# Altium schematic sheet outputs.SchDoc
size B; SheetNumber: 2; SheetTotal: 3
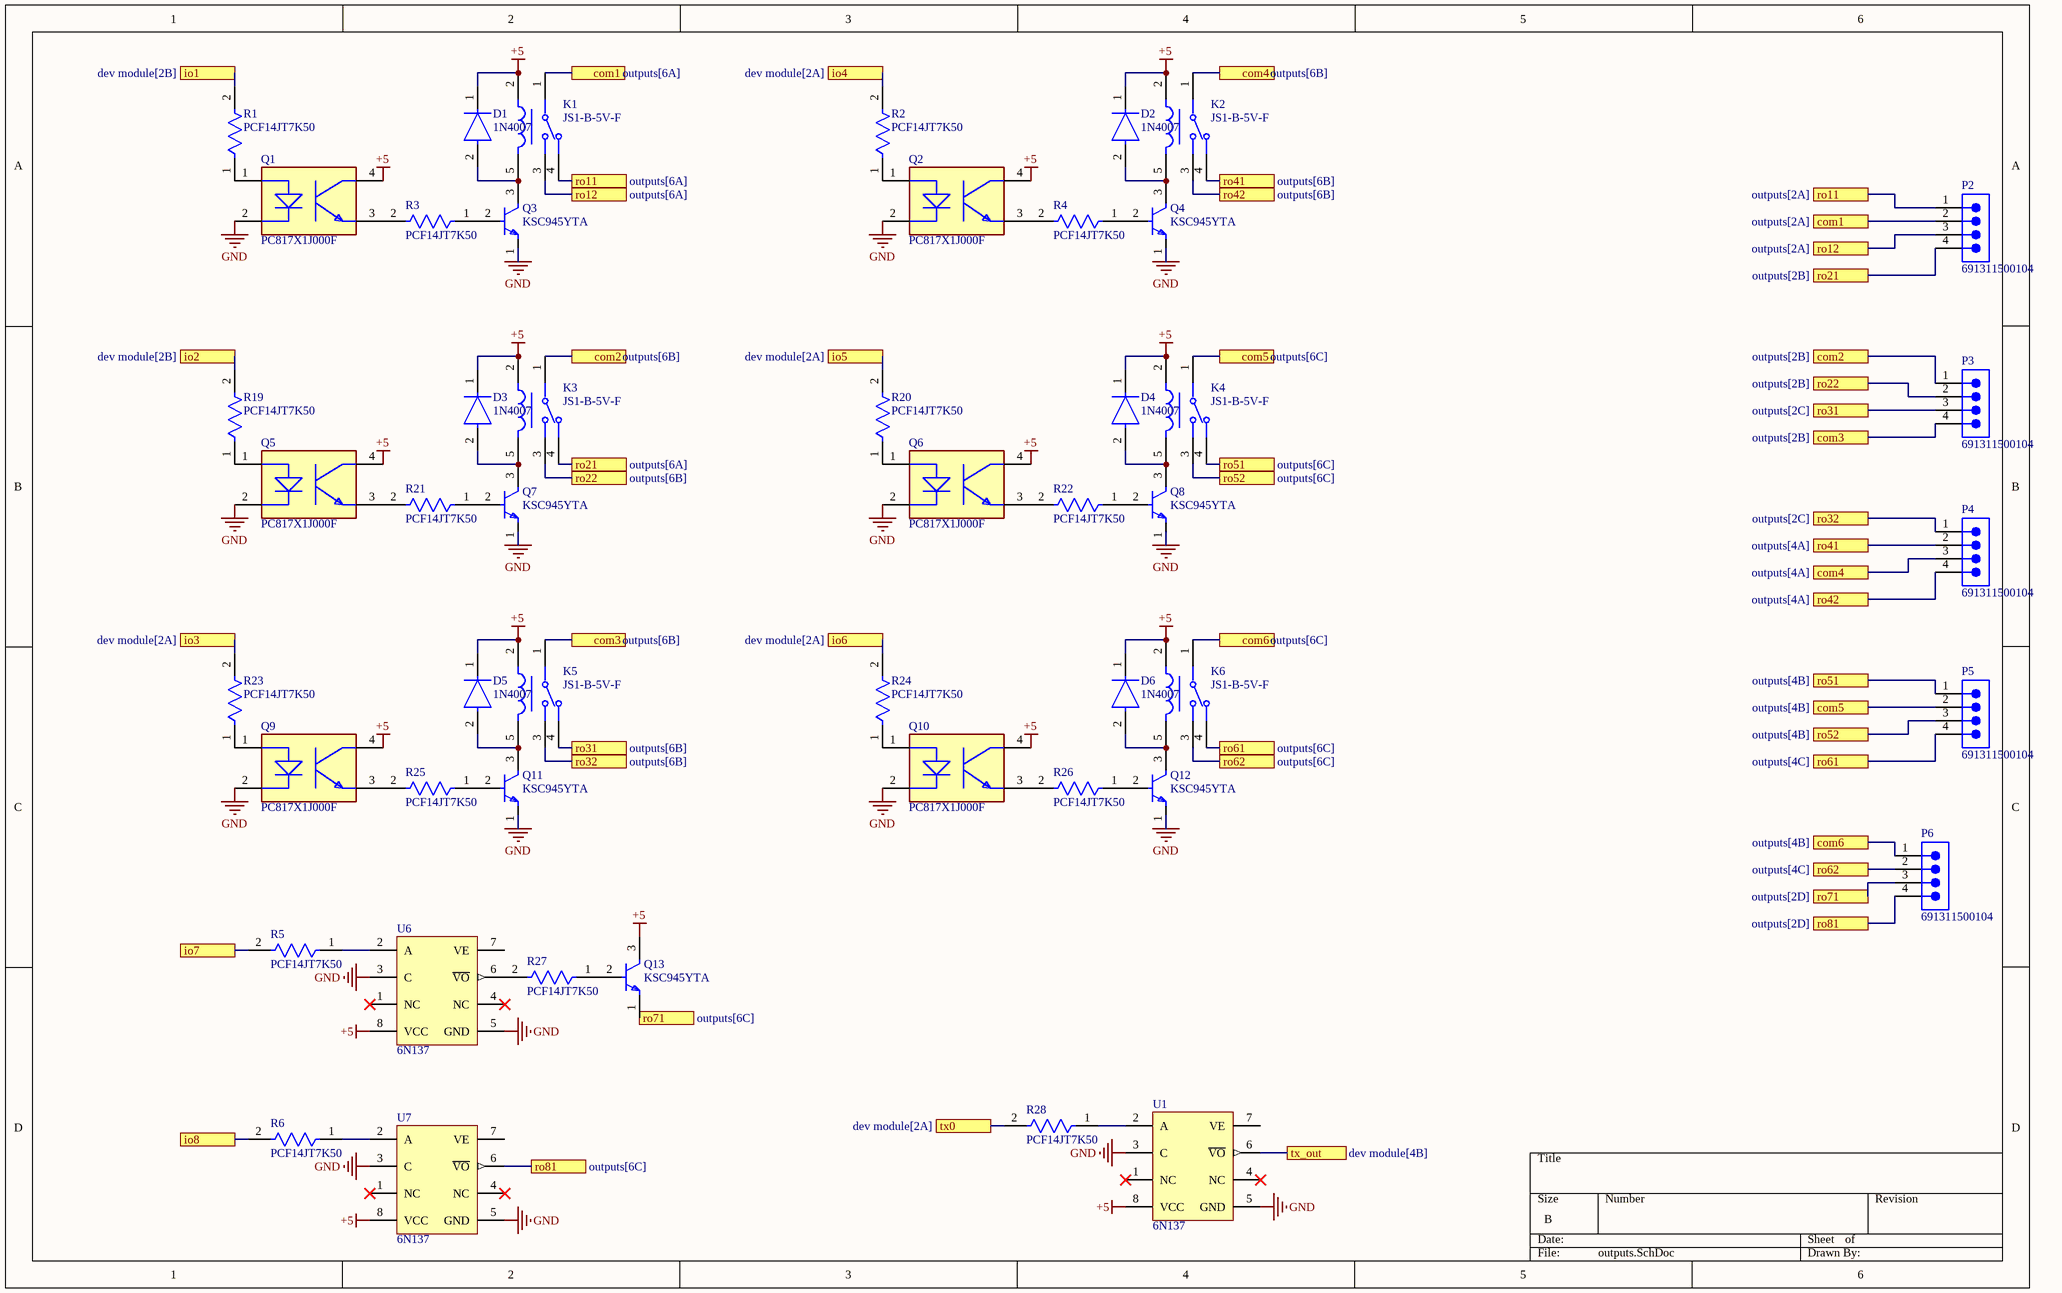
[diagram p0: outputs.SchDoc]

## Parts
D1  1N4007  [FP-1N4007-MFG]
D2  1N4007  [FP-1N4007-MFG]
D3  1N4007  [FP-1N4007-MFG]
D4  1N4007  [FP-1N4007-MFG]
D5  1N4007  [FP-1N4007-MFG]
D6  1N4007  [FP-1N4007-MFG]
K1  JS1-B-5V-F  [FP-JS1-B-5V-F-MFG]
K2  JS1-B-5V-F  [FP-JS1-B-5V-F-MFG]
K3  JS1-B-5V-F  [FP-JS1-B-5V-F-MFG]
K4  JS1-B-5V-F  [FP-JS1-B-5V-F-MFG]
K5  JS1-B-5V-F  [FP-JS1-B-5V-F-MFG]
K6  JS1-B-5V-F  [FP-JS1-B-5V-F-MFG]
P2  691311500104  [691311500104]
P3  691311500104  [691311500104]
P4  691311500104  [691311500104]
P5  691311500104  [691311500104]
P6  691311500104  [691311500104]
Q1  PC817X1J000F  [FP-PC817X1J000F-MFG]
Q2  PC817X1J000F  [FP-PC817X1J000F-MFG]
Q3  KSC945YTA  [FP-135AR-MFG]
Q4  KSC945YTA  [FP-135AR-MFG]
Q5  PC817X1J000F  [FP-PC817X1J000F-MFG]
Q6  PC817X1J000F  [FP-PC817X1J000F-MFG]
Q7  KSC945YTA  [FP-135AR-MFG]
Q8  KSC945YTA  [FP-135AR-MFG]
Q9  PC817X1J000F  [FP-PC817X1J000F-MFG]
Q10  PC817X1J000F  [FP-PC817X1J000F-MFG]
Q11  KSC945YTA  [FP-135AR-MFG]
Q12  KSC945YTA  [FP-135AR-MFG]
Q13  KSC945YTA  [FP-135AR-MFG]
R1  PCF14JT7K50  [FP-CF14-MFG]
R2  PCF14JT7K50  [FP-CF14-MFG]
R3  PCF14JT7K50  [FP-CF14-MFG]
R4  PCF14JT7K50  [FP-CF14-MFG]
R5  PCF14JT7K50  [FP-CF14-MFG]
R6  PCF14JT7K50  [FP-CF14-MFG]
R19  PCF14JT7K50  [FP-CF14-MFG]
R20  PCF14JT7K50  [FP-CF14-MFG]
R21  PCF14JT7K50  [FP-CF14-MFG]
R22  PCF14JT7K50  [FP-CF14-MFG]
R23  PCF14JT7K50  [FP-CF14-MFG]
R24  PCF14JT7K50  [FP-CF14-MFG]
R25  PCF14JT7K50  [FP-CF14-MFG]
R26  PCF14JT7K50  [FP-CF14-MFG]
R27  PCF14JT7K50  [FP-CF14-MFG]
R28  PCF14JT7K50  [FP-CF14-MFG]
U1  6N137  [VISH-DIP-8_A]
U6  6N137  [VISH-DIP-8_A]
U7  6N137  [VISH-DIP-8_A]

## Ports
com1 (see outputs[2A]), com1 (see outputs[6A]), com2 (see outputs[2B]), com2 (see outputs[6B]), com3 (see outputs[2B]), com3 (see outputs[6B]), com4 (see outputs[4A]), com4 (see outputs[6B]), com5 (see outputs[4B]), com5 (see outputs[6C]), com6 (see outputs[4B]), com6 (see outputs[6C]), io1 (see dev module[2B]), io2 (see dev module[2B]), io3 (see dev module[2A]), io4 (see dev module[2A]), io5 (see dev module[2A]), io6 (see dev module[2A]), io7, io8, ro11 (see outputs[2A]), ro11 (see outputs[6A]), ro12 (see outputs[2A]), ro12 (see outputs[6A]), ro21 (see outputs[2B]), ro21 (see outputs[6A]), ro22 (see outputs[2B]), ro22 (see outputs[6B]), ro31 (see outputs[2C]), ro31 (see outputs[6B]), ro32 (see outputs[2C]), ro32 (see outputs[6B]), ro41 (see outputs[4A]), ro41 (see outputs[6B]), ro42 (see outputs[4A]), ro42 (see outputs[6B]), ro51 (see outputs[4B]), ro51 (see outputs[6C]), ro52 (see outputs[4B]), ro52 (see outputs[6C]), ro61 (see outputs[4C]), ro61 (see outputs[6C]), ro62 (see outputs[4C]), ro62 (see outputs[6C]), ro71 (see outputs[2D]), ro71 (see outputs[6C]), ro81 (see outputs[2D]), ro81 (see outputs[6C]), tx0 (see dev module[2A]), tx_out (see dev module[4B])

## Nets
+5: D1.1(C) D2.1(C) D3.1(C) D4.1(C) D5.1(C) D6.1(C) K1.2 K2.2 K3.2 K4.2 K5.2 K6.2 Q1.4(C) Q2.4(C) Q5.4(C) Q6.4(C) Q9.4(C) Q10.4(C) Q13.3(C) U1.8(VCC) U6.8(VCC) U7.8(VCC)
GND: Q1.2(C) Q2.2(C) Q3.1(E) Q4.1(E) Q5.2(C) Q6.2(C) Q7.1(E) Q8.1(E) Q9.2(C) Q10.2(C) Q11.1(E) Q12.1(E) U1.3(C) U1.5(GND) U6.3(C) U6.5(GND) U7.3(C) U7.5(GND)
com1: K1.1(COM) P2.2 ; port com1
com2: K3.1(COM) P3.1 ; port com2
com3: K5.1(COM) P3.4 ; port com3
com4: K2.1(COM) P4.3 ; port com4
com5: K4.1(COM) P5.2 ; port com5
com6: K6.1(COM) P6.1 ; port com6
io1: R1.2 ; port io1
io2: R19.2 ; port io2
io3: R23.2 ; port io3
io4: R2.2 ; port io4
io5: R20.2 ; port io5
io6: R24.2 ; port io6
io7: R5.2 ; port io7
io8: R6.2 ; port io8
ro11: K1.4(NC) P2.1 ; port ro11
ro12: K1.3(NO) P2.3 ; port ro12
ro21: K3.4(NC) P2.4 ; port ro21
ro22: K3.3(NO) P3.2 ; port ro22
ro31: K5.4(NC) P3.3 ; port ro31
ro32: K5.3(NO) P4.1 ; port ro32
ro41: K2.4(NC) P4.2 ; port ro41
ro42: K2.3(NO) P4.4 ; port ro42
ro51: K4.4(NC) P5.1 ; port ro51
ro52: K4.3(NO) P5.3 ; port ro52
ro61: K6.4(NC) P5.4 ; port ro61
ro62: K6.3(NO) P6.2 ; port ro62
ro71: P6.3 Q13.1(E) ; port ro71
ro81: P6.4 U7.6(~{VO}) ; port ro81
tx0: R28.2 ; port tx0
tx_out: U1.6(~{VO}) ; port tx_out
NetD1_2: D1.2(A) K1.5 Q3.3(C)
NetD2_2: D2.2(A) K2.5 Q4.3(C)
NetD3_2: D3.2(A) K3.5 Q7.3(C)
NetD4_2: D4.2(A) K4.5 Q8.3(C)
NetD5_2: D5.2(A) K5.5 Q11.3(C)
NetD6_2: D6.2(A) K6.5 Q12.3(C)
NetQ1_1: Q1.1(A) R1.1
NetQ1_3: Q1.3(E) R3.2
NetQ2_1: Q2.1(A) R2.1
NetQ2_3: Q2.3(E) R4.2
NetQ3_2: Q3.2(B) R3.1
NetQ4_2: Q4.2(B) R4.1
NetQ5_1: Q5.1(A) R19.1
NetQ5_3: Q5.3(E) R21.2
NetQ6_1: Q6.1(A) R20.1
NetQ6_3: Q6.3(E) R22.2
NetQ7_2: Q7.2(B) R21.1
NetQ8_2: Q8.2(B) R22.1
NetQ9_1: Q9.1(A) R23.1
NetQ9_3: Q9.3(E) R25.2
NetQ10_1: Q10.1(A) R24.1
NetQ10_3: Q10.3(E) R26.2
NetQ11_2: Q11.2(B) R25.1
NetQ12_2: Q12.2(B) R26.1
NetQ13_2: Q13.2(B) R27.1
NetR5_1: R5.1 U6.2(A)
NetR6_1: R6.1 U7.2(A)
NetR27_2: R27.2 U6.6(~{VO})
NetR28_1: R28.1 U1.2(A)

Not connected (* = marked no-connect by the designer): U1 1(NC)* 4(NC)* 7(VE); U6 1(NC)* 4(NC)* 7(VE); U7 1(NC)* 4(NC)* 7(VE)

## Library data of the parts
D1-D6 = CMP-123542-000001-1: Rectifier diode 1000 V 1 A DO-41, ,; Manufacturer: Diotec; Max Surge Forward Current: 27A; Forward Current: 1A; Max Junction Temp: +175°C; Reverse Voltage: 1000V; Value: 15pF; Peak Reverse Current: 5uA; Category: Diode; Temperature Range Low: -50°C; Automotive: No; Temperature: -50°C to +175°C; Lead Free: Yes; ComponentLink2Description: Datasheet; Max Repetitive Reverse Voltage: 1000V; ComponentLink2URL: https://datasheet.octopart.com/1N4007-Diotec-datasheet-62346875.pdf; Manufacturer Part Number: 1N4007; Device Class L3: Rectifier Diodes; Height: 2.8mm; Octopart: https://octopart.com/1n4007-diotec-4040411; Package: 1N4007; Temperature Range High: +175°C; Device Class L1: Discrete Semiconductors; Device Class L2: Diodes; RoHS: TRUE; Capacitance: 15pF; Ipc Land Pattern Name: DIOAD888W100L520D280
K1-K6 = CMP-00287-00689748-1: JS1-B-5V-F Electromechanical Relay 5VDC 69.4Ohm 5ADC/10AAC SPDT (22x16x16.4)mm THT Power Relay; NexarPartId: 689748; Coil Voltage (DC): 5V; Coil Resistance: 69.4Ω; Coil Power: 360mW; Voltage Rating (AC): 250V; Number of Contacts: 1; Coil Type: Non-Latching; Current Rating: 10A; Coil Current: 72mA; Operate Time: 10ms; Max Voltage Rating (DC): 100V; Relay Type: General Purpose; Throw Configuration: SPDT; Depth: 16mm; Lead Free: Lead Free; Contact Material: Silver, Tin; Max Operating Temperature: 85°C; Number of Pins: 5; Mount: Through Hole; Ambient Temperature Range High: 85°C; Height: 16mm; Weight: 12g; Power Consumption: 360mW; REACH SVHC: No SVHC; Min Operating Temperature: -40°C; Termination: PC Pin; Width: 22mm; Max Current Rating: 10A; Packaging: Bulk; Length: 22mm; Switching Current: 10A; Power Rating: 360mW; RoHS: Compliant; Max Voltage Rating (AC): 250V; Release Time: 10ms; Contact Current Rating: 10A
P2-P6 = CMP-1502-02148-2: NexarPartId: 8917749; Pitch: 5.08mm; Number of Positions Per Level: 4; Gender: Male; Voltage: 300V; Current: 20A; Number of Levels: 1; Orientation: Vertical; Number of Pins: 4; Mount: Through Hole; Number of Contacts: 4; Length: 8.5mm; Number of Rows: 1; Contact Plating: Tin; Color: Green; Termination: Solder; Contact Material: Brass; REACH SVHC: Unknown; RoHS: Compliant; Lead Pitch: 5.08mm; Width: 22.32mm; Height: 12mm; Packaging: Box
Q1 Q2 Q5 Q6 Q9 Q10 = CMP-65434-000003-1: OPTOISOLATOR 5KV TRANS 4DIP; Collector Emitter Saturation Voltage: 200mV; Forward Voltage: 1.4V; Power Dissipation: 200mW; Input Current: 20mA; Max Collector Current: 50mA; Collector Emitter Breakdown Voltage: 80V; Rise Time: 18000ns; Number of Elements: 1; Reverse Breakdown Voltage: 6V; Current Transfer Ratio: 600%; Min Operating Temperature: -30°C; Number of Pins: 4; Radiation Hardening: No; Output Current per Channel: 50mA; Case/Package: DIP; Fall Time: 18000ns; Forward Current: 50mA; Isolation Voltage: 5kV; Package Quantity: 2000; Max Operating Temperature: 100°C; Packaging: Sleeve; Max Input Current: 50mA; Output Voltage: 80V; Max Power Dissipation: 200mW; Mount: Through Hole; Number of Channels: 1; Collector Emitter Voltage (VCEO): 80V
Q3 Q4 Q7 Q8 Q11-Q13 = CMP-00278-84329536-1: KSC945YTA Bipolar (BJT) Single Transistor, NPN, 50 V, 300 MHz, 250 mW, 150 mA, 120; Manufacturer Lifecycle Status: ACTIVE; Collector Base Voltage (VCBO): 60V; Frequency: 300MHz; Max Frequency: 1MHz; Max Junction Temperature (Tj): 150°C; Max Power Dissipation: 250mW; Max Collector Current: 150mA; Collector Emitter Breakdown Voltage: 50V; Emitter Base Voltage (VEBO): 5V; hFE Min: 40; Collector Emitter Saturation Voltage: 150mV; Number of Elements: 1; Schedule B: 8541210080, 8541210080; Max Operating Temperature: 150°C; RoHS: Compliant; Gain Bandwidth Product: 300MHz; Width: 3.86mm; REACH SVHC: No SVHC; Height: 4.58mm; Number of Pins: 3; Radiation Hardening: No; Weight: 240mg; Element Configuration: Single; Transition Frequency: 300MHz; NexarPartId: 84329536; Voltage Rating (DC): 50V; Power Dissipation: 250mW; Min Operating Temperature: -55°C; Max Breakdown Voltage: 50V; Lifecycle Status: Production; Collector Emitter Voltage (VCEO): 50V; Mount: Through Hole; Length: 4.58mm; Polarity: NPN; Lead Free: Lead Free; Current Rating: 150mA; Case/Package: TO-92-3
R1-R6 R19-R28 = CMP-26528-000003-1: RES 7.5K OHM 1/4W 5% AXIAL; Max Power Dissipation: 250mW; Temperature Coefficient: -400ppm/°C; Resistance: 7.5kR; RoHS Compliant: Yes; Lead Free: Lead Free; Max Operating Temperature: 155°C; Case/Package: Axial; Tolerance: 5%; Power Rating: 250mW; Diameter: 2.3mm; Features: Flame Retardant Coating; Series: CF; Resistor Type: Carbon Film; Number of Terminations: 2; Length: 0.256inch; Min Operating Temperature: -55°C; Contact Plating: Tin; Packaging: Tape and Reel; Mount: Through Hole; Radiation Hardening: No
U1 U6 U7 = CMP-2000-05669-1: High Speed Optocoupler, Single and Dual, 10 MBd, 5 V, -40 to 100 degC, 8-Pin DIP, RoHS, Tube; Manufacturer: Vishay; No. of Channels: 1Channel; Isolation Voltage: 5.3kV; Data Rate: 10Mbaud; SVHC: ToBeAdvised; No. of Pins: 8Pins; Package Description: 8-Pin Double In-line Package, Body 10.16 x 6.7 mm, Pitch 2.54 mm; Manufacturer URL: http://www.vishay.com/; Product Range: -; Optocoupler Case Style: DIP; Mounting Technology: ThroughHole; Packaging: Each; Package Reference: DIP-8; Datasheet Version: Rev. 1.9, 03/2015; Datasheet URL: http://www.vishay.com/docs/84732/6n137.pdf